# Altium project SealHAT.PrjPcb
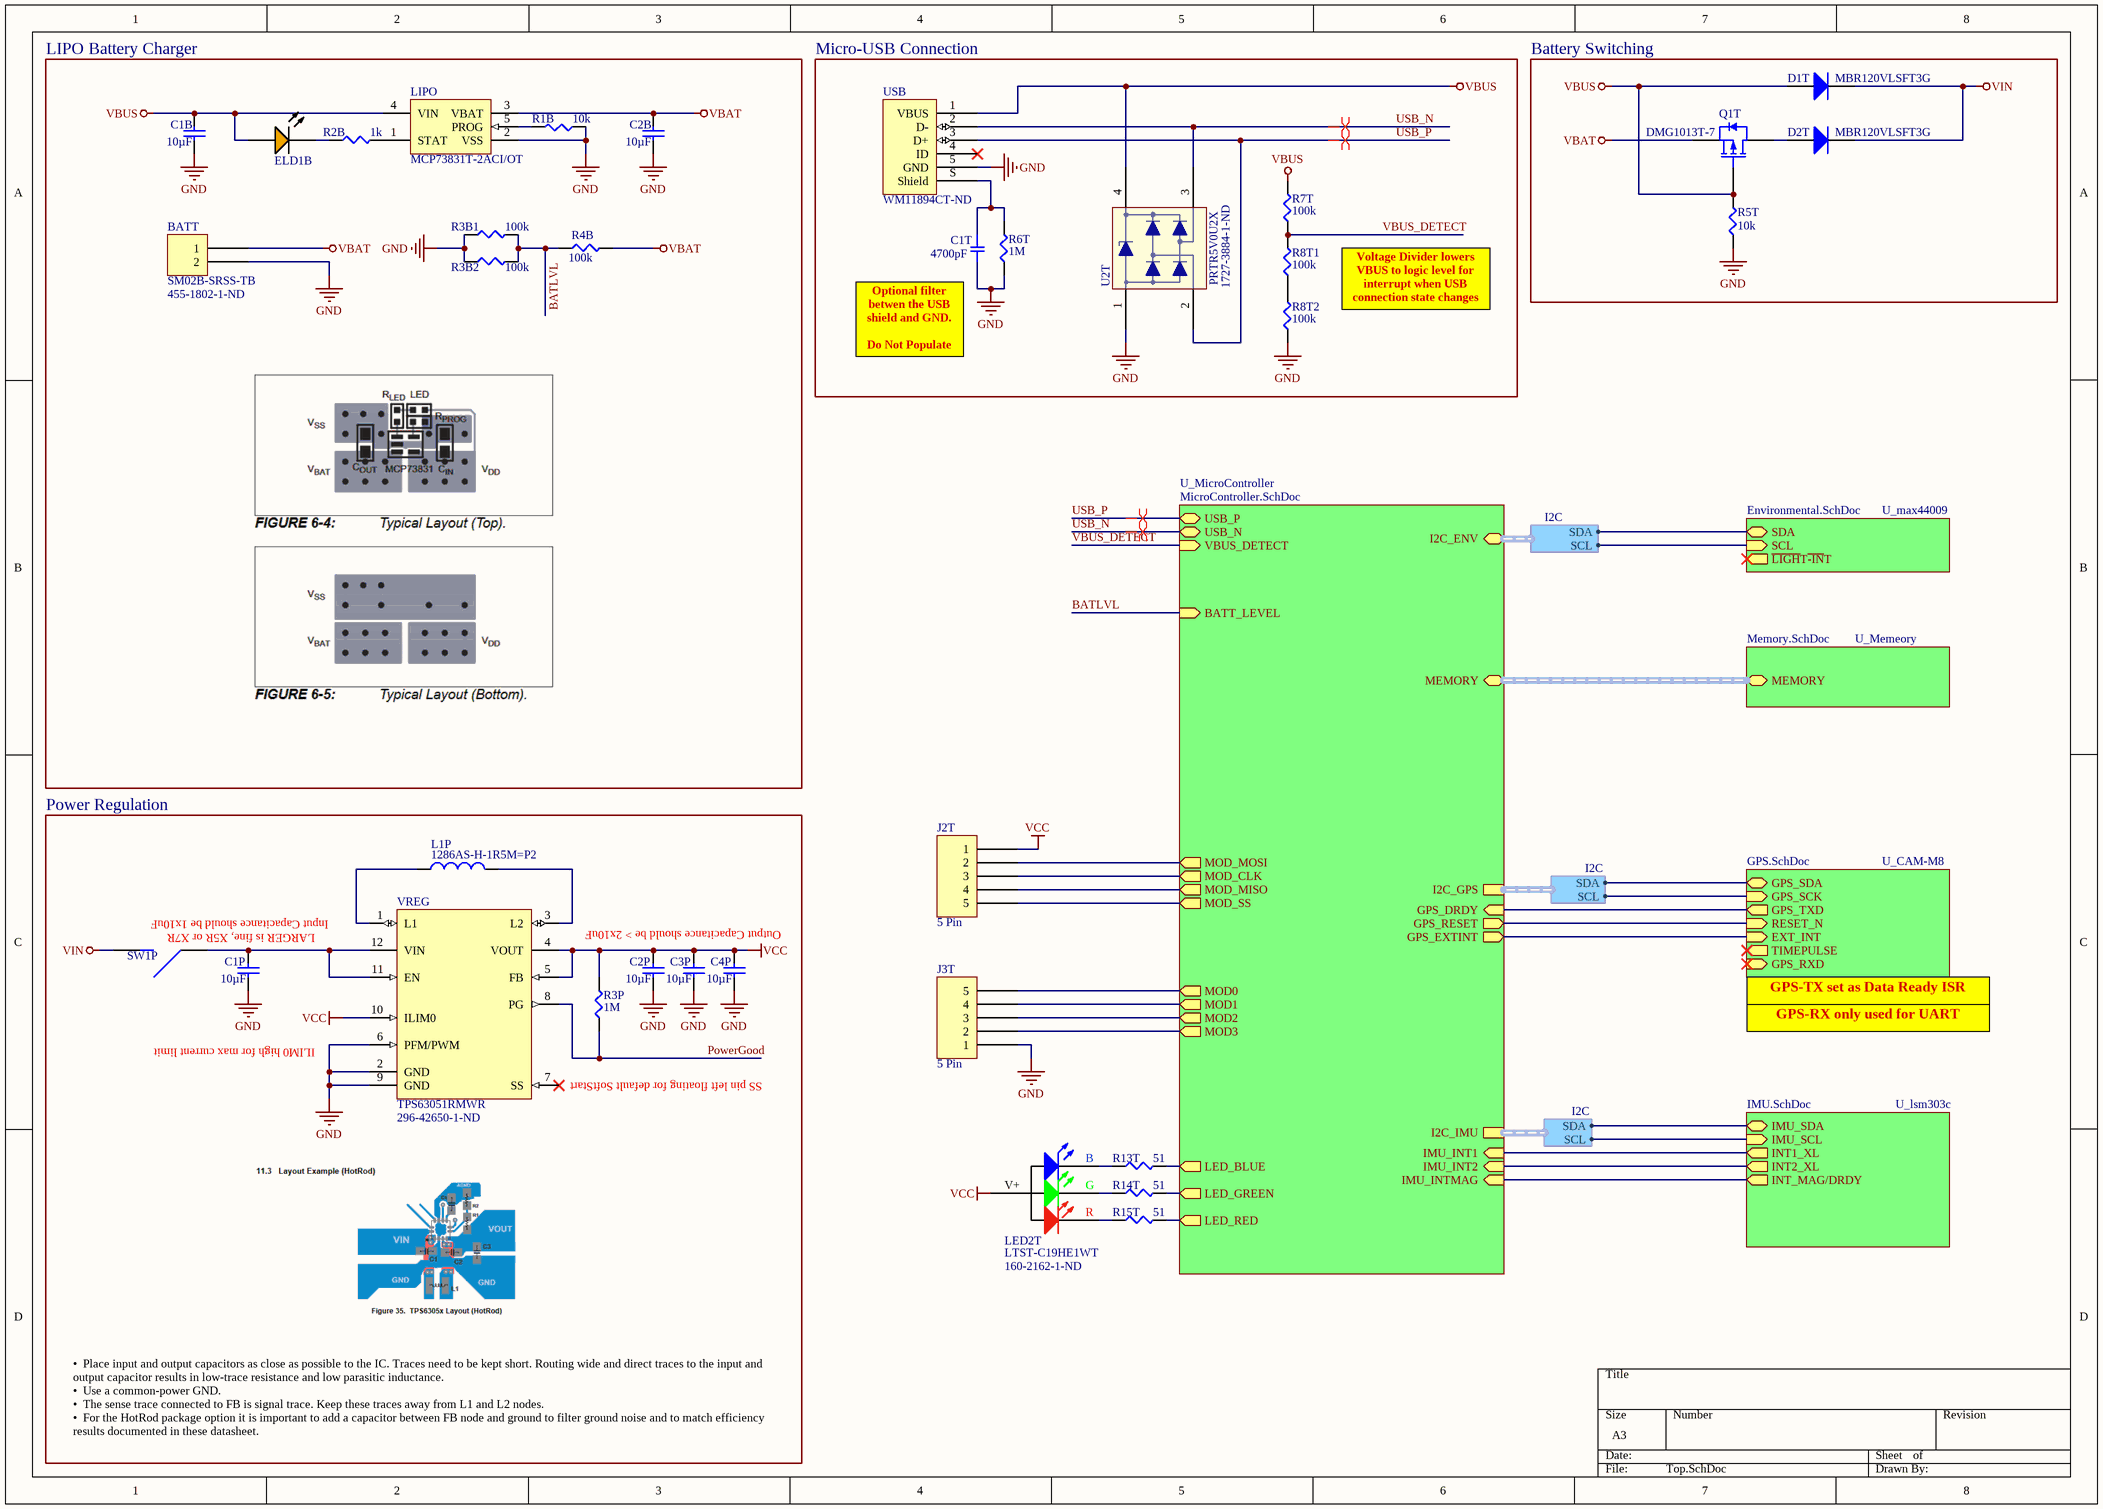
[diagram p0: Top.SchDoc]
6 sheets, 78 parts. Net scope: hierarchical (ports join the sheet entries above them; power ports are global).
Sheets:
  Top.SchDoc
    U_max44009 = Environmental.SchDoc
    U_CAM-M8 = GPS.SchDoc
    U_Memeory = Memory.SchDoc
    U_lsm303c = IMU.SchDoc
    U_MicroController = MicroController.SchDoc

## Sheet Top.SchDoc
size A3; DocumentNumber: 1; SheetNumber: 1; SheetTotal: 6

### Parts
BATT  SM02B-SRSS-TB  Supplier Part Number 1: 455-1802-1-ND  [JST S2B-PH-SM4]
C1B  Capacitance: 10µF  [C0603N]  (hidden comment: GRT188R61C106KE13D)
C1P  Capacitance: 10µF  [C0603N]  (hidden comment: GRT188R61C106KE13D)
C1T  value 4700pF  [C0603N]  (hidden comment: GCM188R72A472KA37D)
C2B  Capacitance: 10µF  [C0603N]  (hidden comment: GRT188R61C106KE13D)
C2P  Capacitance: 10µF  [C0603N]  (hidden comment: GRT188R61C106KE13D)
C3P  Capacitance: 10µF  [C0603N]  (hidden comment: GRT188R61C106KE13D)
C4P  Capacitance: 10µF  [C0603N]  (hidden comment: GRT188R61C106KE13D)
D1T  MBR120VLSFT3G  [MBR120VLSFT3G]
D2T  MBR120VLSFT3G  [MBR120VLSFT3G]
ELD1B  LTST-C190KFKT  [LED_0603]  (value not drawn)
J2T  5 Pin  [Pinhead_1x5]
J3T  5 Pin  [Pinhead_1x5]
L1P  1286AS-H-1R5M=P2  [L0806_N]
LED2T  LTST-C19HE1WT  Supplier Part Number 1: 160-2162-1-ND  [LED_0606_160X160X35]
LIPO  MCP73831T-2ACI/OT  [SOT-23-5_MC]
Q1T  DMG1013T-7  [SOT50P175X90-3N]
R1B  value 10k  [SMD-0603-RES]  (hidden comment: ERJ-3EKF1002V)
R2B  value 1k  [SMD-0603-RES]  (hidden comment: ERJ-3EKF1001V)
R3B1  value 100k  [SMD-0603-RES]  (hidden comment: ERJ-3EKF1003V)
R3B2  value 100k  [SMD-0603-RES]  (hidden comment: ERJ-3EKF1003V)
R3P  value 1M  [SMD-0603-RES]  (hidden comment: ERJ-3EKF1004V)
R4B  value 100k  [SMD-0603-RES]  (hidden comment: ERJ-3EKF1003V)
R5T  value 10k  [SMD-0603-RES]  (hidden comment: ERJ-3EKF1002V)
R6T  value 1M  [SMD-0603-RES]  (hidden comment: ERJ-3EKF1004V)
R7T  value 100k  [SMD-0603-RES]  (hidden comment: ERJ-3EKF1003V)
R8T1  value 100k  [SMD-0603-RES]  (hidden comment: ERJ-3EKF1003V)
R8T2  value 100k  [SMD-0603-RES]  (hidden comment: ERJ-3EKF1003V)
R13T  value 51  [SMD-0603-RES]  (hidden comment: ERJ-3EKF51R0V)
R14T  value 51  [SMD-0603-RES]  (hidden comment: ERJ-3EKF51R0V)
R15T  value 51  [SMD-0603-RES]  (hidden comment: ERJ-3EKF51R0V)
SW1P  SPST  [Pinhead254_90_1x2]  (value not drawn)
U2T  PRTR5V0U2X  Supplier Part Number 1: 1727-3884-1-ND  [SOT143B]
USB  WM11894CT-ND  [MOLEX_105443-1101]
VREG  TPS63051RMWR  Supplier Part Number 1: 296-42650-1-ND  [QFN12P50_250X250X100]

### Blocks framed on the sheet
LIPO Battery Charger: BATT C1B C2B ELD1B LIPO R1B R2B R3B1 R3B2 R4B
Micro-USB Connection: C1T R6T R7T R8T1 R8T2 U2T USB
Battery Switching: D1T D2T Q1T R5T
Power Regulation: C1P C2P C3P C4P L1P R3P SW1P VREG

### Sub-sheets
U_CAM-M8 = GPS.SchDoc: GPS_SCK (in), GPS_SDA (bidir), EXT_INT (in), TIMEPULSE (out), GPS_RXD (in), GPS_TXD (out), RESET_N (in)
U_lsm303c = IMU.SchDoc: IMU_SCL (in), IMU_SDA (bidir), INT1_XL (out), INT_MAG/DRDY (out), INT2_XL (out)
U_max44009 = Environmental.SchDoc: SDA (bidir), SCL (in), ~{LIGH}T~{-IN}T (out)
U_Memeory = Memory.SchDoc: MEMORY (harness MEMORY)
U_MicroController = MicroController.SchDoc: USB_P (bidir), USB_N (bidir), I2C_GPS (harness I2C), VBUS_DETECT (in), BATT_LEVEL (in), GPS_DRDY (in), GPS_EXTINT (out), I2C_IMU (harness I2C), IMU_INT1 (in), IMU_INT2 (in), IMU_INTMAG (in), I2C_ENV (harness I2C), LED_BLUE (out), LED_GREEN (out), LED_RED (out), MOD3 (out), MOD0 (out), MOD_CLK (out), MOD1 (out), MOD_MOSI (out), MOD_SS (out), MOD2 (out), MOD_MISO (out), GPS_RESET (out), MEMORY (harness MEMORY)

### Harnesses
I2C: SCL, SDA

### Nets
GND: BATT.2 C1B.1 C1P.1 C1T.2 C2B.1 C2P.1 C3P.1 C4P.1 J3T.1 LIPO.2(VSS) R1B.1 R3B1.1 R3B2.1 R5T.1 R6T.1 R8T2.1 U2T.1(GND) USB.5(GND) VREG.2(GND) VREG.6(PFM/PWM) VREG.9(GND)
VBAT: BATT.1 C2B.2 LIPO.3(VBAT) Q1T.2(S) R4B.2
VBUS: C1B.2 D1T.1(A) ELD1B.1(A) LIPO.4(VIN) Q1T.1(G) R5T.2 R7T.2 U2T.4(VCC) USB.1(VBUS)
VCC: C2P.2 C3P.2 C4P.2 J2T.1 LED2T.4(A) R3P.2 VREG.4(VOUT) VREG.5(FB) VREG.10(ILIM0)
VIN: D1T.2(K) D2T.2(K) SW1P.2
BATLVL: R3B1.2 R3B2.2 R4B.1 ; sheet U_MicroController/BATT_LEVEL
ENV_SCL: sheet U_max44009/SCL, sheet U_MicroController/I2C_ENV.SCL
ENV_SDA: sheet U_max44009/SDA, sheet U_MicroController/I2C_ENV.SDA
GPS_EXTINT: sheet U_CAM-M8/EXT_INT, sheet U_MicroController/GPS_EXTINT
GPS_RESET: sheet U_CAM-M8/RESET_N, sheet U_MicroController/GPS_RESET
GPS_SCL: sheet U_CAM-M8/GPS_SCK, sheet U_MicroController/I2C_GPS.SCL
GPS_SDA: sheet U_CAM-M8/GPS_SDA, sheet U_MicroController/I2C_GPS.SDA
GPS_TXD: sheet U_CAM-M8/GPS_TXD, sheet U_MicroController/GPS_DRDY
IMU_INT1: sheet U_lsm303c/INT1_XL, sheet U_MicroController/IMU_INT1
IMU_INT2: sheet U_lsm303c/INT2_XL, sheet U_MicroController/IMU_INT2
IMU_INTMAG: sheet U_lsm303c/INT_MAG/DRDY, sheet U_MicroController/IMU_INTMAG
IMU_SCL: sheet U_lsm303c/IMU_SCL, sheet U_MicroController/I2C_IMU.SCL
IMU_SDA: sheet U_lsm303c/IMU_SDA, sheet U_MicroController/I2C_IMU.SDA
LED_BLUE: R13T.2 ; sheet U_MicroController/LED_BLUE
LED_GREEN: R14T.2 ; sheet U_MicroController/LED_GREEN
LED_RED: R15T.2 ; sheet U_MicroController/LED_RED
MOD0: J3T.5 ; sheet U_MicroController/MOD0
MOD1: J3T.4 ; sheet U_MicroController/MOD1
MOD2: J3T.3 ; sheet U_MicroController/MOD2
MOD3: J3T.2 ; sheet U_MicroController/MOD3
MOD_CLK: J2T.3 ; sheet U_MicroController/MOD_CLK
MOD_CS: J2T.5 ; sheet U_MicroController/MOD_SS
MOD_MISO: J2T.4 ; sheet U_MicroController/MOD_MISO
MOD_MOSI: J2T.2 ; sheet U_MicroController/MOD_MOSI
PowerGood: R3P.1 VREG.8(PG)
USB_N: U2T.3(I/O2) USB.2(D-) ; sheet U_MicroController/USB_N
USB_P: U2T.2(I/O1) USB.3(D+) ; sheet U_MicroController/USB_P
VBUS_DETECT: R7T.1 R8T1.2 ; sheet U_MicroController/VBUS_DETECT
NetC1P_2: C1P.2 SW1P.1 VREG.11(EN) VREG.12(VIN)
NetC1T_1: C1T.1 R6T.2 USB.S(Shield)
NetD2T_1: D2T.1(A) Q1T.3(D)
NetELD1B_2: ELD1B.2(K) R2B.1
NetL1P_1: L1P.1 VREG.1(L1)
NetL1P_2: L1P.2 VREG.3(L2)
NetLED2T_1: LED2T.1(R) R15T.1
NetLED2T_2: LED2T.2(G) R14T.1
NetLED2T_3: LED2T.3(B) R13T.1
NetLIPO_1: LIPO.1(STAT) R2B.2
NetLIPO_5: LIPO.5(PROG) R1B.2
NetR8T1_1: R8T1.1 R8T2.2

Not connected (* = marked no-connect by the designer): USB 4(ID)*; VREG 7(SS)*

### Buses and harness runs
harness sheet U_Memeory/MEMORY = sheet U_MicroController/MEMORY

### Layout directives
differential pair: USB_N, USB_P

### Notes on the sheet
- Voltage Divider lowers VBUS to logic level for interrupt when USB connection state changes
- (near C1T) Optional filter betwen the USB shield and GND.
  Do Not Populate
- Input Capacitance should be 1x10uF
- Output Capacitance should be > 2x10uF
- (near SW1P) LARGER is fine, X5R or X7R
- ILIM0 high for max current limit
- GPS-RX only used for UART
- GPS-TX set as Data Ready ISR
- (near VREG) SS pin left floating for default SoftStart
- •  Place input and output capacitors as close as possible to the IC. Traces need to be kept short. Routing wide and direct traces to the input and output capacitor results in low-trace resistance and low parasitic inductance.
  •  Use a common-power GND.
  •  The sense trace connected to FB is signal trace. Keep these traces away from L1 and L2 nodes.
  •  For the HotRod package option it is important to add a capacitor between FB node and ground to filter ground noise and to match efficiency results documented in these datasheet.
- (in symbol LTST-C19HE1WT) V+

### Library data of the parts
BATT = 2 Pin: Part Number: SM02B-SRSS-TB; Supplier 1: Digi-Key
C1B C1P C2B C2P C3P C4P = CAPACITOR_NP: 10µF 16V Ceramic Capacitor X5R 0603; HOUSEPART: NO; POPULATE: 1; TOLERANCE: ±10%; VOLTAGE: 10V; DeviceName: GRT188R61C106KE13D; LibraryName: MF_Passives; DeviceSetName: CAPACITOR_NP; MPN: GRT188R61C106KE13D; MF_PARTNUM: GRT188R61C106KE13D; Supplier 1: Digi-Key; Supplier Part Number 1: 490-12317-1-ND
C1T = GCM188R72A472KA37D: CAP CER 4700PF 100V X7R 0603; Manufacturer: Murata Electronics North America; Factory Stock: 0; Unit Price (USD): 0.1; Minimum Quantity: 1; Tolerance: ±10%; Datasheets: http://www.murata.com/~/media/webrenewal/support/library/catalog/products/capacitor/mlcc/c03e.ashx; Image: //media.digikey.com/Renders/Murata%20Renders/0603%28GCM188%29.jpg; Digi-Key Part Number: 490-4930-1-ND; Part Number: GCM188R72A472KA37D; Quantity Available: 3550; @ qty: 0; Packaging: Cut Tape (CT); Series: GCM; Part Status: Active; Voltage: 100V; Temperature Coefficient: X7R; Operating Temperature: -55°C ~ 125°C; Features: -; Ratings: AEC-Q200; Applications: Automotive; Mounting Type: Surface Mount, MLCC; Package / Case: 0603 (1608 Metric); Size / Dimension: 0.063" L x 0.031" W (1.60mm x 0.80mm); Height - Seated (Max): -; Thickness (Max): 0.035" (0.90mm); Lead Spacing: -; Lead Style: -; Supplier 1: Digi-Key; Supplier Part Number 1: 490-4930-1-ND
D1T D2T = MBR120VLSFT3G: Diode Schottky 20V 1A Surface Mount SOD-123FL; Manufacturer Part Number: MBR120VLSFT3G; Supplier 1: Digi-Key; Supplier Part Number 1: MBR120VLSFT3GOSCT-ND
ELD1B = CMP-1544850-3: LED Uni-Color Orange, 75 mW, 30 mA; Forward Voltage: 2.00 V; Luminous Intensity: 60.0 mcd; Lens Type: Non-Diffused; Wavelength: 611 nm; Viewing Angle: 130 °; Lead-Free Status: Lead Free; Case/Package (SI): 1608; Size-Width: 800 µm; PackageReference: C190KFKT; Size-Height: 800 µm; Color: Orange; Packaging: Cut Tape (CT), Tape & Reel (TR); RoHS: Compliant; Seller Landing  Url: https://octopart-clicks.com/click/track?country=US&ak=8157f166&sig=0e2a9b5&sid=459&ppid=549896&vpid=1324662&ct=offers; Octopart Url: http://octopart.com/ltst-c190kfkt-lite-on-549896; Mounting Style: Surface Mount, Vertical; OctopartID: 99ca50c8d8a4460d; DatasheetVersion: Rev. I, 09/2011; Manufacturer Part Number: LTST-C190KFKT; Case/Package: 0603; Size-Length: 1.60 mm; PackageDescription: 2-Pin Surface Mount Device, Body 1.6 x 0.8 mm; Supplier 1: Digi-Key; Supplier Part Number 1: 160-1434-1-ND
L1P = INDUCTOR: FIXED IND 1.5UH 2A 114 MOHM SMD; POPULATE: 1; DeviceSetName: INDUCTOR; MPN: 1286AS-H-1R5M=P2
LED2T = LTST-C19HE1WT: RGB LED 0606 (1616 metric); Lead-Free Status: Lead Free; Wavelength - Dominant: 624nm Red, 525nm Green, 470nm Blue; package metric: 1616; Configuration: Common Anode; Octopart URL: http://octopart.com/ltst-c19he1wt-lite-on-13128904; OctopartID: 1946d08468e8c681; RoHS: Compliant; Manufacturer Part Number: LTST-C19HE1WT; package: 0606; Height (Max): 0.45mm; Mounting Type: SMT; Supplier 1: Digi-Key
LIPO = MCHP-MCP73831T-5: MCP73831 Series Single-Cell Li-Ion/Li-Polymer Battery Charge Controller SOT-23-5; Input Voltage (DC): 3.75 V (min); Lead-Free Status: Lead Free; Supply Voltage (DC): 6.00 V (max); Output Voltage: 7.30 V; RoHS: Compliant; Octopart URL: https://octopart-clicks.com/click/track?country=US&ak=8157f166&sig=05342b1&sid=459&ppid=55392281&vpid=188043932&ct=offers; OctopartID: d79a1dddcae5085d; Manufacturer Part Number: MCP73831T-2ACI/OT; REACH SVHC Compliance: No SVHC; Case/Package: SOT-23; Lifecycle Status: Active; Packaging: Cut Tape (CT), Tape & Reel (TR); Number of Pins: 5; Mounting Style: Surface Mount; Octopart Url: http://octopart.com/mcp73831t-2aci%2Fot-microchip-55392281; Supplier 1: Digi-Key; Supplier Part Number 1: MCP73831T-2ACI/OTCT-ND
Q1T = DMG1013T-7c2930a883c7b1d54: P-Channel SOT-523; Lead-Free Status: Lead Free; RoHS: Compliant; Lifecycle Status: Active; Polarity: P-Channel; Manufacturer Part Number: DMG1013T-7; REACH SVHC Compliance: No SVHC; Octopart URL: http://octopart.com/dmg1013t-7-diodes+inc.-17947534; OctopartID: c2930a883c7b1d54; Supplier 1: Digi-Key; Supplier Part Number 1: DMG1013T-7DICT-ND
R1B = ERJ-3EKF1002V: RES SMD 10K OHM 1% 1/10W 0603; Manufacturer: Panasonic Electronic Components; Factory Stock: 0; Unit Price (USD): 0.00379; @ qty: 1500; Minimum Quantity: 1; Power (Watts): 0.1W, 1/10W; Temperature Coefficient: ±100ppm/°C; Part Number: ERJ-3EKF1002V; Datasheets: http://industrial.panasonic.com/www-cgi/jvcr13pz.cgi?E+PZ+3+AOA0002+ERJ3EKF1002V+7+WW; Image: //media.digikey.com/Photos/Panasonic%20Photos/MFG_ERJ-P6W%20Series.jpg; Digi-Key Part Number: P10.0KHCT-ND; Quantity Available: 6703141; Packaging: Cut Tape (CT); Series: ERJ; Part Status: Active; Tolerance: ±1%; Composition: Thick Film; Features: Automotive AEC-Q200; Operating Temperature: -55°C ~ 155°C; Package / Case: 0603 (1608 Metric); Supplier Device Package: 0603; Size / Dimension: 0.063" L x 0.031" W (1.60mm x 0.80mm); Height - Seated (Max): 0.022" (0.55mm); Number of Terminations: 2; Failure Rate: -; Supplier 1: Digi-Key; Supplier Part Number 1: P10.0KHCT-ND
R2B = ERJ-3EKF1001V: RES SMD 1K OHM 1% 1/10W 0603; Manufacturer: Panasonic Electronic Components; Factory Stock: 0; Unit Price (USD): 0.00379; @ qty: 1500; Minimum Quantity: 1; Power (Watts): 0.1W, 1/10W; Temperature Coefficient: ±100ppm/°C; Part Number: ERJ-3EKF1001V; Datasheets: http://industrial.panasonic.com/www-cgi/jvcr13pz.cgi?E+PZ+3+AOA0002+ERJ3EKF1001V+7+WW; Image: //media.digikey.com/Photos/Panasonic%20Photos/MFG_ERJ-P6W%20Series.jpg; Digi-Key Part Number: P1.00KHCT-ND; Quantity Available: 5218845; Packaging: Cut Tape (CT); Series: ERJ; Part Status: Active; Tolerance: ±1%; Composition: Thick Film; Features: Automotive AEC-Q200; Operating Temperature: -55°C ~ 155°C; Package / Case: 0603 (1608 Metric); Supplier Device Package: 0603; Size / Dimension: 0.063" L x 0.031" W (1.60mm x 0.80mm); Height - Seated (Max): 0.022" (0.55mm); Number of Terminations: 2; Failure Rate: -; Supplier 1: Digi-Key; Supplier Part Number 1: P1.00KHCT-ND
R3B1 R3B2 R4B = ERJ-3EKF1003V: RES SMD 100K OHM 1% 1/10W 0603; Manufacturer: Panasonic Electronic Components; MPN: P100KHCT-ND; Factory Stock: 0; Unit Price (USD): 0.00379; @ qty: 1500; Minimum Quantity: 1; Power (Watts): 0.1W, 1/10W; Temperature Coefficient: ±100ppm/°C; Part Number: ERJ-3EKF1003V; Datasheets: http://industrial.panasonic.com/www-cgi/jvcr13pz.cgi?E+PZ+3+AOA0002+ERJ3EKF1003V+7+WW; Image: //media.digikey.com/Photos/Panasonic%20Photos/MFG_ERJ-P6W%20Series.jpg; Digi-Key Part Number: P100KHCT-ND; Quantity Available: 2179804; Packaging: Cut Tape (CT); Series: ERJ; Part Status: Active; Tolerance: ±1%; Composition: Thick Film; Features: Automotive AEC-Q200; Operating Temperature: -55°C ~ 155°C; Package / Case: 0603 (1608 Metric); Supplier Device Package: 0603; Size / Dimension: 0.063" L x 0.031" W (1.60mm x 0.80mm); Height - Seated (Max): 0.022" (0.55mm); Number of Terminations: 2; Failure Rate: -; Supplier 1: Digi-Key; Supplier Part Number 1: P100KHCT-ND
R3P R6T = ERJ-3EKF1004V: RES SMD 1M OHM 1% 1/10W 0603; Manufacturer: Panasonic Electronic Components; Factory Stock: 0; Unit Price (USD): 0.00379; @ qty: 1500; Minimum Quantity: 1; Power (Watts): 0.1W, 1/10W; Temperature Coefficient: ±100ppm/°C; Part Number: ERJ-3EKF1004V; Datasheets: http://industrial.panasonic.com/www-cgi/jvcr13pz.cgi?E+PZ+3+AOA0002+ERJ3EKF1004V+7+WW; Image: //media.digikey.com/Photos/Panasonic%20Photos/MFG_ERJ-P6W%20Series.jpg; Digi-Key Part Number: P1.00MHCT-ND; Quantity Available: 1632074; Packaging: Cut Tape (CT); Series: ERJ; Part Status: Active; Tolerance: ±1%; Composition: Thick Film; Features: Automotive AEC-Q200; Operating Temperature: -55°C ~ 155°C; Package / Case: 0603 (1608 Metric); Supplier Device Package: 0603; Size / Dimension: 0.063" L x 0.031" W (1.60mm x 0.80mm); Height - Seated (Max): 0.022" (0.55mm); Number of Terminations: 2; Failure Rate: -; Supplier 1: Digi-Key; Supplier Part Number 1: P1.00MHCT-ND
R5T = ERJ-3EKF1002V: RES SMD 10K OHM 1% 1/10W 0603; Manufacturer: Panasonic Electronic Components; MPN: P10.0KHCT-ND; Factory Stock: 0; Unit Price (USD): 0.00379; @ qty: 1500; Minimum Quantity: 1; Power (Watts): 0.1W, 1/10W; Temperature Coefficient: ±100ppm/°C; Part Number: ERJ-3EKF1002V; Datasheets: http://industrial.panasonic.com/www-cgi/jvcr13pz.cgi?E+PZ+3+AOA0002+ERJ3EKF1002V+7+WW; Image: //media.digikey.com/Photos/Panasonic%20Photos/MFG_ERJ-P6W%20Series.jpg; Digi-Key Part Number: P10.0KHCT-ND; Quantity Available: 6703141; Packaging: Cut Tape (CT); Series: ERJ; Part Status: Active; Tolerance: ±1%; Composition: Thick Film; Features: Automotive AEC-Q200; Operating Temperature: -55°C ~ 155°C; Package / Case: 0603 (1608 Metric); Supplier Device Package: 0603; Size / Dimension: 0.063" L x 0.031" W (1.60mm x 0.80mm); Height - Seated (Max): 0.022" (0.55mm); Number of Terminations: 2; Failure Rate: -; Supplier 1: Digi-Key; Supplier Part Number 1: P10.0KHCT-ND
R7T R8T1 R8T2 = ERJ-3EKF1003V: RES SMD 100K OHM 1% 1/10W 0603; Manufacturer: Panasonic Electronic Components; Factory Stock: 0; Unit Price (USD): 0.00379; @ qty: 1500; Minimum Quantity: 1; Power (Watts): 0.1W, 1/10W; Temperature Coefficient: ±100ppm/°C; Part Number: ERJ-3EKF1003V; Datasheets: http://industrial.panasonic.com/www-cgi/jvcr13pz.cgi?E+PZ+3+AOA0002+ERJ3EKF1003V+7+WW; Image: //media.digikey.com/Photos/Panasonic%20Photos/MFG_ERJ-P6W%20Series.jpg; Digi-Key Part Number: P100KHCT-ND; Quantity Available: 2179804; Packaging: Cut Tape (CT); Series: ERJ; Part Status: Active; Tolerance: ±1%; Composition: Thick Film; Features: Automotive AEC-Q200; Operating Temperature: -55°C ~ 155°C; Package / Case: 0603 (1608 Metric); Supplier Device Package: 0603; Size / Dimension: 0.063" L x 0.031" W (1.60mm x 0.80mm); Height - Seated (Max): 0.022" (0.55mm); Number of Terminations: 2; Failure Rate: -; Supplier 1: Digi-Key; Supplier Part Number 1: P100KHCT-ND
R13T R14T R15T = ERJ-3EKF51R0V: RES SMD 51 OHM 1% 1/10W 0603; Manufacturer: Panasonic Electronic Components; Factory Stock: 0; Unit Price (USD): 0.00379; @ qty: 1500; Minimum Quantity: 1; Power (Watts): 0.1W, 1/10W; Temperature Coefficient: ±100ppm/°C; Part Number: ERJ-3EKF51R0V; Datasheets: http://industrial.panasonic.com/www-cgi/jvcr13pz.cgi?E+PZ+3+AOA0002+ERJ3EKF51R0V+7+WW; Image: //media.digikey.com/Photos/Panasonic%20Photos/MFG_ERJ-P6W%20Series.jpg; Digi-Key Part Number: P51.0HCT-ND; Quantity Available: 129747; Packaging: Cut Tape (CT); Series: ERJ; Part Status: Active; Tolerance: ±1%; Composition: Thick Film; Features: Automotive AEC-Q200; Operating Temperature: -55°C ~ 155°C; Package / Case: 0603 (1608 Metric); Supplier Device Package: 0603; Size / Dimension: 0.063" L x 0.031" W (1.60mm x 0.80mm); Height - Seated (Max): 0.022" (0.55mm); Number of Terminations: 2; Failure Rate: -; Supplier 1: Digi-Key; Supplier Part Number 1: P51.0HCT-ND
SW1P = SPST switch
U2T = PRTR5V0U2X: C: Copyright (C) 2015 Accelerated Designs. All rights reserved; Vendor: NXP; Built_By: EMA_UL_Team; Value: PRTR5V0U2X; Manufacturer_Part_Number: PRTR5V0U2X; Supplier 1: Digi-Key
USB = USB 2.0 Type B Micro: Supplier 1: Digi-Key; Supplier Part Number 1: WM11894CT-ND
VREG = TPS63051RMWR: Single Inductor Buck Boost Converter 12-VQFN; Manufacturer: Texas Instruments; Current - Output: 500mA; Vin Min: 2.5V; Vin Max: 5.5V; Freqency: 2.5MHz; Package: 12-VFQFN; MPN: TPS63051RMWR; Value: *; Supplier 1: Digi-Key

## Sheet Environmental.SchDoc: SealHAT: Environmental Subsystem
size Letter
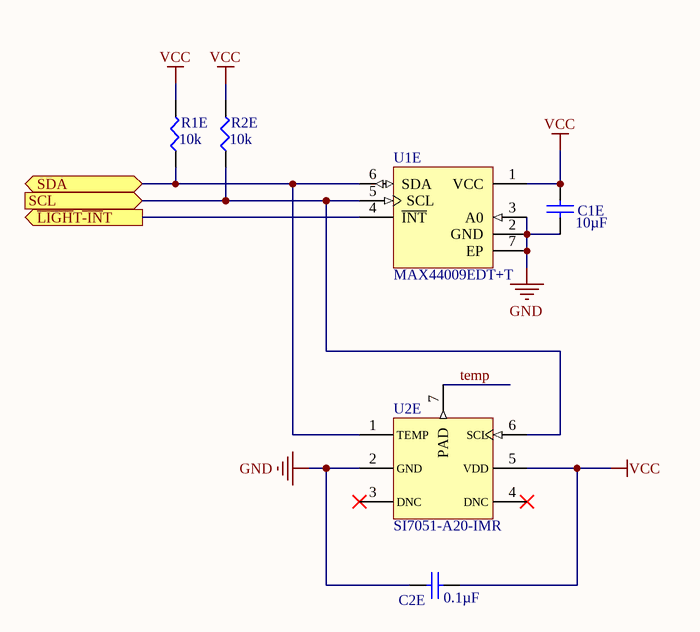
[diagram p1: Environmental.SchDoc]

### Parts
C1E  Capacitance: 10µF  [C0603N]  (hidden comment: GRT188R61C106KE13D)
C2E  Capacitance: 0.1µF  [C0603N]  (hidden comment: GCM188R71C104KA37D)
R1E  value 10k  [SMD-0603-RES]  (hidden comment: ERJ-3EKF1002V)
R2E  value 10k  [SMD-0603-RES]  (hidden comment: ERJ-3EKF1002V)
U1E  MAX44009EDT+T  [21-0490D]
U2E  SI7051-A20-IMR  [si705x-hand]

### Ports
SCL (in), SDA (bidir), ~{LIGH}T~{-IN}T (out)

### Nets
GND: C1E.1 C2E.1 U1E.2(GND) U1E.3(A0) U1E.7(EP) U2E.2(GND)
VCC: C1E.2 C2E.2 R1E.2 R2E.2 U1E.1(VCC) U2E.5(VDD)
~{LIGH}T~{-IN}T: U1E.4(~{INT}) ; port ~{LIGH}T~{-IN}T
ENV_SCL: R2E.1 U1E.5(SCL) U2E.6(SCL) ; port SCL
ENV_SDA: R1E.1 U1E.6(SDA) U2E.1(TEMP) ; port SDA
temp: U2E.7(PAD)

Not connected (* = marked no-connect by the designer): U2E 3(DNC)* 4(DNC)*

### Notes on the sheet
- Title
- Size:
- Date:
- Letter
- Number:
- Time:
- Revision:
- Sheet
- of
- File:

### Library data of the parts
C1E = CAPACITOR_NP: as C1B on sheet Top; DeviceName: GRT188R61C106KE13D; LibraryName: MF_Passives; DeviceSetName: CAPACITOR_NP; MPN: GRT188R61C106KE13D; MF_PARTNUM: GRT188R61C106KE13D; Supplier 1: Digi-Key; Supplier Part Number 1: 490-12317-1-ND
C2E = CAPACITOR_NP: HOUSEPART: NO; POPULATE: 1; TOLERANCE: ±10%; VOLTAGE: 16V; Temperature Coefficient: X7R; DeviceName: GCM188R71C104KA37D; LibraryName: MF_Passives; DeviceSetName: CAPACITOR_NP; MPN: GCM188R71C104KA37D; MF_PARTNUM: GCM188R71C104KA37D; Supplier 1: Digi-Key; Supplier Part Number 1: 490-4774-1-ND
R1E R2E = ERJ-3EKF1002V: as R1B on sheet Top; Part Number: ERJ-3EKF1002V; Datasheets: http://industrial.panasonic.com/www-cgi/jvcr13pz.cgi?E+PZ+3+AOA0002+ERJ3EKF1002V+7+WW; Image: //media.digikey.com/Photos/Panasonic%20Photos/MFG_ERJ-P6W%20Series.jpg; Digi-Key Part Number: P10.0KHCT-ND; Quantity Available: 6703141; Packaging: Cut Tape (CT); Series: ERJ; Part Status: Active; Tolerance: ±1%; Composition: Thick Film; Features: Automotive AEC-Q200; Operating Temperature: -55°C ~ 155°C; Package / Case: 0603 (1608 Metric); Supplier Device Package: 0603; Size / Dimension: 0.063" L x 0.031" W (1.60mm x 0.80mm); Height - Seated (Max): 0.022" (0.55mm); Number of Terminations: 2; Failure Rate: -; Supplier 1: Digi-Key; Supplier Part Number 1: P10.0KHCT-ND
U1E = MAX44009EDT+T: MAX44009 light sensor; Octopart Url: https://octopart.com/max44009edt%2Bt-maxim+integrated-44380498; Manufacturer Part Number: MAX44009EDT+T; Lifecycle Status: Active; OctopartID: e71f2cb0f32b38d8; Case/Package: 6-UDFN; Supplier 1: Digi-Key; Supplier Part Number 1: MAX44009EDT+TCT-ND
U2E = CMP-6e6fa3261226b1a8-2: Temperature Sensor tal, Local -40°C ~ 125°C 14 b 6-DFN (3x3); Octopart URL: https://octopart.com/si7051-a20-im-silicon+labs-71522607; RoHS: Compliant; Case/Package: 6-DFN; Manufacturer Part Number: SI7051-A20-IMR; Supplier 1: Digi-Key; Supplier Part Number 1: 336-4764-1-ND

## Sheet GPS.SchDoc: SealHAT: GPS Subsystem
size Letter; DocumentNumber: 5; SheetNumber: 5; SheetTotal: 6
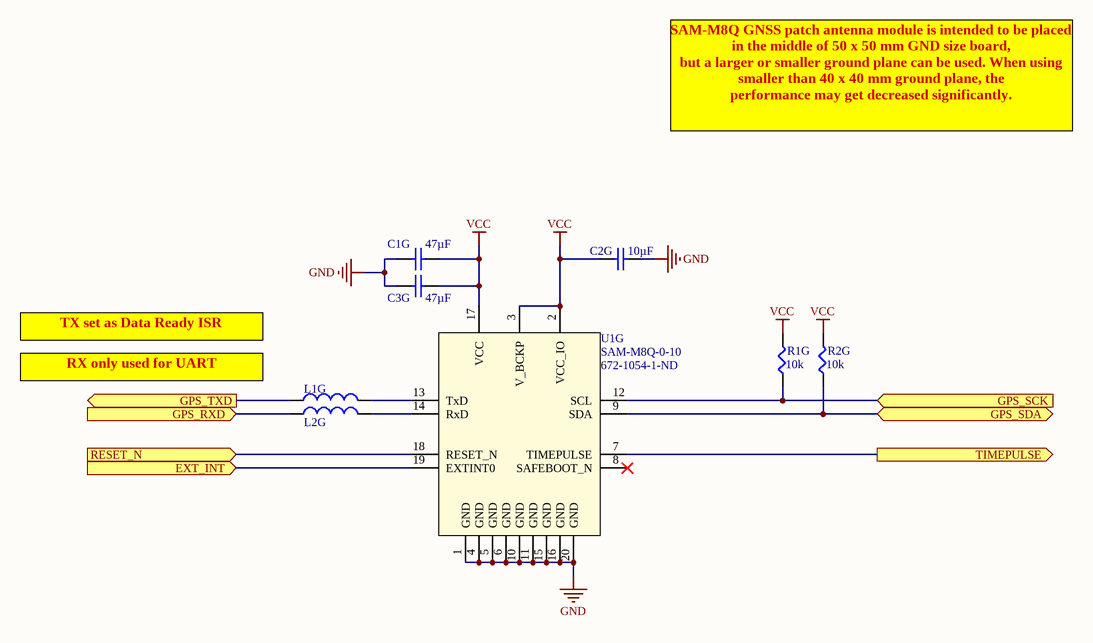
[diagram p2: GPS.SchDoc]

### Parts
C1G  Capacitance: 47µF  [C0805N]  (hidden comment: GRM21BR61A476ME15L)
C2G  Capacitance: 10µF  [C0603N]  (hidden comment: GRT188R61C106KE13D)
C3G  Capacitance: 47µF  [C0805N]  (hidden comment: GRM21BR61A476ME15L)
L1G  LI0603G221R-10  [R0603L]  (value not drawn)
L2G  LI0603G221R-10  [R0603L]  (value not drawn)
R1G  value 10k  [SMD-0603-RES]  (hidden comment: ERJ-3EKF1002V)
R2G  value 10k  [SMD-0603-RES]  (hidden comment: ERJ-3EKF1002V)
U1G  SAM-M8Q-0-10  Supplier Part Number 1: 672-1054-1-ND  [SAM-M8Q]

### Ports
EXT_INT (in), GPS_RXD (in), GPS_SCK (in), GPS_SDA (bidir), GPS_TXD (out), RESET_N (in), TIMEPULSE (out)

### Nets
GND: C1G.2 C2G.2 C3G.2 U1G.1(GND) U1G.4(GND) U1G.5(GND) U1G.6(GND) U1G.10(GND) U1G.11(GND) U1G.15(GND) U1G.16(GND) U1G.20(GND)
VCC: C1G.1 C2G.1 C3G.1 R1G.2 R2G.2 U1G.2(VCC_IO) U1G.3(V_BCKP) U1G.17(VCC)
GPS_EXTINT: U1G.19(EXTINT0) ; port EXT_INT
GPS_RESET: U1G.18(RESET_N) ; port RESET_N
GPS_RXD: L2G.1 ; port GPS_RXD
GPS_SCL: R1G.1 U1G.12(SCL) ; port GPS_SCK
GPS_SDA: R2G.1 U1G.9(SDA) ; port GPS_SDA
GPS_TXD: L1G.1 ; port GPS_TXD
TIMEPULSE: U1G.7(TIMEPULSE) ; port TIMEPULSE
NetL1G_2: L1G.2 U1G.13(TxD)
NetL2G_2: L2G.2 U1G.14(RxD)

Not connected (* = marked no-connect by the designer): U1G 8(SAFEBOOT_N)*

### Notes on the sheet
- SAM‑M8Q GNSS patch antenna module is intended to be placed in the middle of 50 x 50 mm GND size board,
  but a larger or smaller ground plane can be used. When using smaller than 40 x 40 mm ground plane, the
  performance may get decreased significantly.
- TX set as Data Ready ISR
- RX only used for UART
- Title
- Size:
- Date:
- Letter
- Number:
- Time:
- Revision:
- Sheet
- of
- File:

### Library data of the parts
C1G C3G = CAPACITOR_NP: 47µF 10V Ceramic Capacitor X5R 0805; HOUSEPART: NO; POPULATE: 1; TOLERANCE: ±20%; VOLTAGE: 6.3V; DeviceName: GRM21BR61A476ME15L; LibraryName: MF_Passives; DeviceSetName: CAPACITOR_NP; MPN: GRM21BR61A476ME15L; URL: https://octopart.com/cl21a476mqclrnc-samsung-24871259; MF_PARTNUM: GRM21BR61A476ME15L; Temperature Coefficient: X5R; Supplier 1: Digi-Key; Supplier Part Number 1: 490-9961-1-ND
C2G = CAPACITOR_NP: as C1B on sheet Top; DeviceName: GRT188R61C106KE13D; LibraryName: MF_Passives; DeviceSetName: CAPACITOR_NP; MPN: GRT188R61C106KE13D; MF_PARTNUM: GRT188R61C106KE13D; Supplier 1: Digi-Key; Supplier Part Number 1: 490-12317-1-ND
L1G L2G = INDUCTOR: HOUSEPART: NO; POPULATE: 1; LibraryName: MF_Passives; DeviceSetName: INDUCTOR; MPN: LI0603G221R-10; URL: https://www.digikey.com/product-detail/en/laird-signal-integrity-products/LI0603G221R-10/240-2368-1-ND/806728; Supplier 1: Digi-Key; Supplier Part Number 1: 240-2368-1-ND
R1G R2G = ERJ-3EKF1002V: as R1B on sheet Top; Part Number: ERJ-3EKF1002V; Datasheets: http://industrial.panasonic.com/www-cgi/jvcr13pz.cgi?E+PZ+3+AOA0002+ERJ3EKF1002V+7+WW; Image: //media.digikey.com/Photos/Panasonic%20Photos/MFG_ERJ-P6W%20Series.jpg; Digi-Key Part Number: P10.0KHCT-ND; Quantity Available: 6703141; Packaging: Cut Tape (CT); Series: ERJ; Part Status: Active; Tolerance: ±1%; Composition: Thick Film; Features: Automotive AEC-Q200; Operating Temperature: -55°C ~ 155°C; Package / Case: 0603 (1608 Metric); Supplier Device Package: 0603; Size / Dimension: 0.063" L x 0.031" W (1.60mm x 0.80mm); Height - Seated (Max): 0.022" (0.55mm); Number of Terminations: 2; Failure Rate: -; Supplier 1: Digi-Key; Supplier Part Number 1: P10.0KHCT-ND
U1G = ublox-sam-m8Q: u-Blox M8 Gnss Antenna Module Tc; Octopart URL: https://octopart.com/sam-m8q-0-10-u-blox-88247750; Manufacturer Part Number: SAM-M8Q-0-10; OctopartID: 87e74baf2f475820; Case/Package: SAM-M8Q; Supplier 1: Digi-Key

## Sheet Memory.SchDoc
size A4; DocumentNumber: 6; SheetNumber: 6; SheetTotal: 6
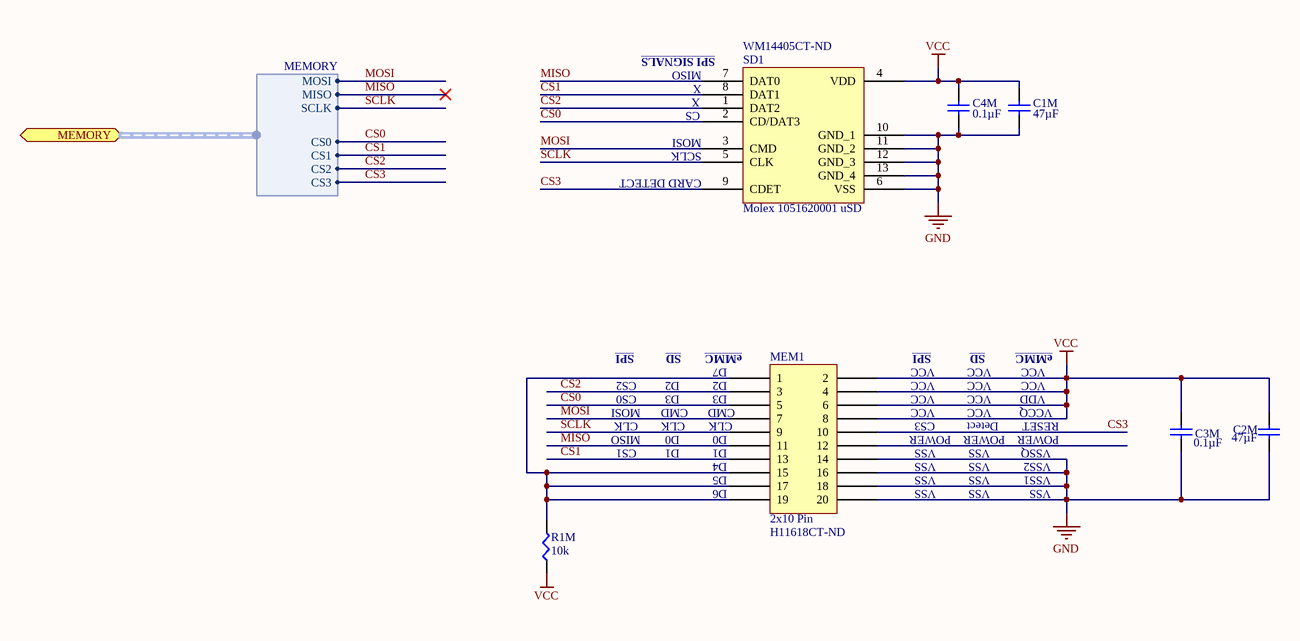
[diagram p3: Memory.SchDoc]

### Parts
C1M  Capacitance: 47µF  [C0805N]  (hidden comment: GRM21BR61A476ME15L)
C2M  Capacitance: 47µF  [C0805N]  (hidden comment: GRM21BR61A476ME15L)
C3M  Capacitance: 0.1µF  [C0603N]  (hidden comment: GCM188R71C104KA37D)
C4M  Capacitance: 0.1µF  [C0603N]  (hidden comment: GCM188R71C104KA37D)
MEM1  2x10 Pin  Supplier Part Number 1: H11618CT-ND  [HIROSE DF40C-20DP-N]
R1M  value 10k  [SMD-0603-RES]  (hidden comment: ERJ-3EKF1002V)
SD1  Molex 1051620001 uSD  Supplier Part Number 1: WM14405CT-ND  [Molex 1051620001]

### Ports
MEMORY (harness MEMORY)

### Harnesses
MEMORY: CS0, CS1, CS2, CS3, MISO, MOSI, SCLK

### Nets
GND: C1M.1 C2M.1 C3M.1 C4M.1 MEM1.14 MEM1.16 MEM1.18 MEM1.20 SD1.6(VSS) SD1.10(GND_1) SD1.11(GND_2) SD1.12(GND_3) SD1.13(GND_4)
VCC: C1M.2 C2M.2 C3M.2 C4M.2 MEM1.2 MEM1.4 MEM1.6 MEM1.8 R1M.1 SD1.4(VDD)
CS0: MEM1.5 SD1.2(CD/DAT3) ; port MEMORY.CS0
CS1: MEM1.13 SD1.8(DAT1) ; port MEMORY.CS1
CS2: MEM1.3 SD1.1(DAT2) ; port MEMORY.CS2
CS3: MEM1.10 SD1.9(CDET) ; port MEMORY.CS3
MISO: MEM1.11 SD1.7(DAT0) ; port MEMORY.MISO  [project net MEM_MISO]
MOSI: MEM1.7 SD1.3(CMD) ; port MEMORY.MOSI  [project net MEM_MOSI]
SCLK: MEM1.9 SD1.5(CLK) ; port MEMORY.SCLK  [project net MEM_CLK]
NetMEM1_1: MEM1.1 MEM1.15 MEM1.17 MEM1.19 R1M.2

Not connected (* = marked no-connect by the designer): MEM1 12

### Notes on the sheet
- (near SD1) X
- (near SD1) CS
- (near SD1) MISO
- (near SD1) SPI SIGNALS
- (near SD1) MOSI
- (near SD1) SCLK
- (near SD1) CARD DETECT
- SPI
- CS2
- D2
- SD
- (near MEM1) D2
- (near MEM1) D7
- (near MEM1) eMMC
- VCC
- eMMC
- CS0
- CS1
- CLK
- MOSI
- MISO
- D3
- D0
- D1
- CMD
- (near MEM1) D3
- (near MEM1) D0
- (near MEM1) D1
- (near MEM1) CLK
- (near MEM1) CMD
- CS3
- VSS
- POWER
- Detect
- VDD
- VSSQ
- VCCQ
- RESET
- (near MEM1) D4
- (near MEM1) D5
- (near MEM1) D6
- VSS2
- VSS1

### Library data of the parts
C1M C2M = CAPACITOR_NP: as C1G on sheet GPS; DeviceName: GRM21BR61A476ME15L; LibraryName: MF_Passives; DeviceSetName: CAPACITOR_NP; MPN: GRM21BR61A476ME15L; URL: https://octopart.com/cl21a476mqclrnc-samsung-24871259; MF_PARTNUM: GRM21BR61A476ME15L; Temperature Coefficient: X5R; Supplier 1: Digi-Key; Supplier Part Number 1: 490-9961-1-ND
C3M C4M = CAPACITOR_NP: as C2E on sheet Environmental; DeviceName: GCM188R71C104KA37D; LibraryName: MF_Passives; DeviceSetName: CAPACITOR_NP; MPN: GCM188R71C104KA37D; MF_PARTNUM: GCM188R71C104KA37D; Supplier 1: Digi-Key; Supplier Part Number 1: 490-4774-1-ND
MEM1 = 2x10 Pin: CONN HDR 20POS; Supplier 1: Digi-Key
R1M = ERJ-3EKF1002V: as R1B on sheet Top; Part Number: ERJ-3EKF1002V; Datasheets: http://industrial.panasonic.com/www-cgi/jvcr13pz.cgi?E+PZ+3+AOA0002+ERJ3EKF1002V+7+WW; Image: //media.digikey.com/Photos/Panasonic%20Photos/MFG_ERJ-P6W%20Series.jpg; Digi-Key Part Number: P10.0KHCT-ND; Quantity Available: 6703141; Packaging: Cut Tape (CT); Series: ERJ; Part Status: Active; Tolerance: ±1%; Composition: Thick Film; Features: Automotive AEC-Q200; Operating Temperature: -55°C ~ 155°C; Package / Case: 0603 (1608 Metric); Supplier Device Package: 0603; Size / Dimension: 0.063" L x 0.031" W (1.60mm x 0.80mm); Height - Seated (Max): 0.022" (0.55mm); Number of Terminations: 2; Failure Rate: -; Supplier 1: Digi-Key; Supplier Part Number 1: P10.0KHCT-ND
SD1 = Molex 1051620001 uSD: 1.45H MICRO SD HEADER WITH D/C P; Supplier 1: Digi-Key

## Sheet IMU.SchDoc
size A; DocumentNumber: 4; SheetNumber: 4; SheetTotal: 6
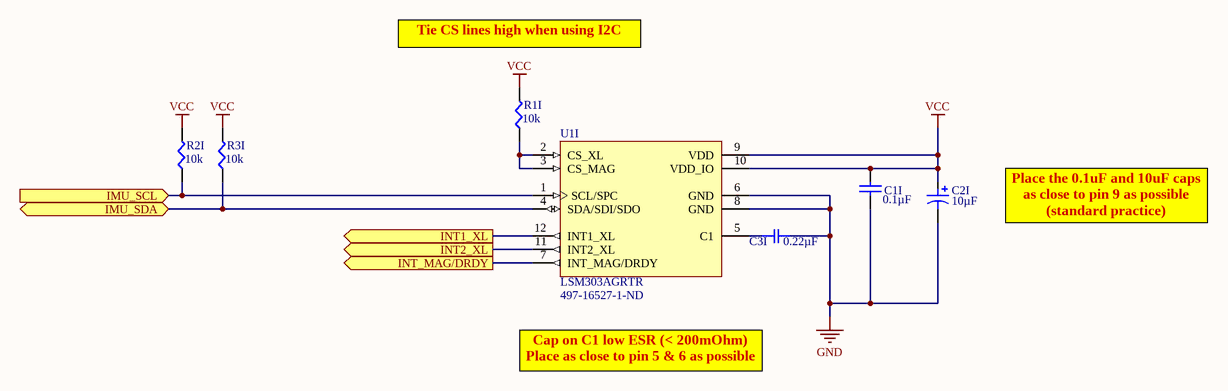
[diagram p4: IMU.SchDoc]

### Parts
C1I  Capacitance: 0.1µF  [C0603N]  (hidden comment: GCM188R71C104KA37D)
C2I  value 10µF  [2917]  (hidden comment: EEF-CD1B100R)
C3I  value 0.22µF  [C0603N]  (hidden comment: GCM188R71E224KA55J)
R1I  value 10k  [SMD-0603-RES]  (hidden comment: ERJ-3EKF1002V)
R2I  value 10k  [SMD-0603-RES]  (hidden comment: ERJ-3EKF1002V)
R3I  value 10k  [SMD-0603-RES]  (hidden comment: ERJ-3EKF1002V)
U1I  LSM303AGRTR  Supplier Part Number 1: 497-16527-1-ND  [LGA12R50P_200X200X100]

### Ports
IMU_SCL (in), IMU_SDA (bidir), INT1_XL (out), INT2_XL (out), INT_MAG/DRDY (out)

### Nets
GND: C1I.1 C2I.2 C3I.2 U1I.6(GND) U1I.8(GND)
VCC: C1I.2 C2I.1 R1I.2 R2I.2 R3I.2 U1I.9(VDD) U1I.10(VDD_IO)
IMU_INT1: U1I.12(INT1_XL) ; port INT1_XL
IMU_INT2: U1I.11(INT2_XL) ; port INT2_XL
IMU_INTMAG: U1I.7(INT_MAG/DRDY) ; port INT_MAG/DRDY
IMU_SCL: R2I.1 U1I.1(SCL/SPC) ; port IMU_SCL
IMU_SDA: R3I.1 U1I.4(SDA/SDI/SDO) ; port IMU_SDA
NetC3I_1: C3I.1 U1I.5(C1)
NetR1I_1: R1I.1 U1I.2(CS_XL) U1I.3(CS_MAG)

### Notes on the sheet
- Tie CS lines high when using I2C
- Place the 0.1uF and 10uF caps as close to pin 9 as possible (standard practice)
- Cap on C1 low ESR (< 200mOhm)
  Place as close to pin 5 & 6 as possible

### Library data of the parts
C1I = CAPACITOR_NP: as C2E on sheet Environmental; DeviceName: GCM188R71C104KA37D; LibraryName: MF_Passives; DeviceSetName: CAPACITOR_NP; MPN: GCM188R71C104KA37D; MF_PARTNUM: GCM188R71C104KA37D; Supplier 1: Digi-Key; Supplier Part Number 1: 490-4774-1-ND
C2I = CAPACITOR_P: 10µF 12.5V Aluminum Polymer Capacitor 2917 (7343 Metric) 60 mOhm 1000 Hrs @ 105°C; HOUSEPART: NO; POPULATE: 1; TOLERANCE: 20%; DeviceSetName: CAPACITOR_P; MPN: EEF-CD1B100R; URL: https://www.digikey.com/product-detail/en/panasonic-electronic-components/EEF-CD1B100R/PCE3166CT-ND/256706; VOLTAGE: 12.5V; Supplier 1: Digi-Key; Supplier Part Number 1: PCE3166CT-ND
C3I = GCM188R71E224KA55J: CAP CER 0.22UF 25V X7R 0603; Manufacturer: Murata Electronics North America; Factory Stock: 0; Unit Price (USD): 0.1; Minimum Quantity: 1; Tolerance: ±10%; Datasheets: http://www.murata.com/~/media/webrenewal/support/library/catalog/products/capacitor/mlcc/c03e.ashx; Image: //media.digikey.com/Renders/Murata%20Renders/0603%28GCM188%29.jpg; Digi-Key Part Number: 490-8017-1-ND; Part Number: GCM188R71E224KA55J; Quantity Available: 10849; @ qty: 0; Packaging: Cut Tape (CT); Series: GCM; Part Status: Active; Voltage: 25V; Temperature Coefficient: X7R; Operating Temperature: -55°C ~ 125°C; Features: -; Ratings: AEC-Q200; Applications: Automotive; Mounting Type: Surface Mount, MLCC; Package / Case: 0603 (1608 Metric); Size / Dimension: 0.063" L x 0.031" W (1.60mm x 0.80mm); Height - Seated (Max): -; Thickness (Max): 0.035" (0.90mm); Lead Spacing: -; Lead Style: -; Supplier 1: Digi-Key; Supplier Part Number 1: 490-8017-1-ND
R1I R2I R3I = ERJ-3EKF1002V: as R1B on sheet Top; Part Number: ERJ-3EKF1002V; Datasheets: http://industrial.panasonic.com/www-cgi/jvcr13pz.cgi?E+PZ+3+AOA0002+ERJ3EKF1002V+7+WW; Image: //media.digikey.com/Photos/Panasonic%20Photos/MFG_ERJ-P6W%20Series.jpg; Digi-Key Part Number: P10.0KHCT-ND; Quantity Available: 6703141; Packaging: Cut Tape (CT); Series: ERJ; Part Status: Active; Tolerance: ±1%; Composition: Thick Film; Features: Automotive AEC-Q200; Operating Temperature: -55°C ~ 155°C; Package / Case: 0603 (1608 Metric); Supplier Device Package: 0603; Size / Dimension: 0.063" L x 0.031" W (1.60mm x 0.80mm); Height - Seated (Max): 0.022" (0.55mm); Number of Terminations: 2; Failure Rate: -; Supplier 1: Digi-Key; Supplier Part Number 1: P10.0KHCT-ND
U1I = CMP-98f6527696964731-1: Ultra-compact high-performance eCompass module: ultra-low power 3D accelerometer and 3D magnetometer; Lifecycle Status: Active; Packaging: Cut Tape (CT); Octopart URL: http://octopart.com/lsm303agrtr-stmicroelectronics-59386630; Manufacturer Part Number: LSM303AGRTR; Case/Package: LGA-12; Supplier 1: Digi-Key

## Sheet MicroController.SchDoc: SealHAT - SAML21 Microcontroller
size Letter; DocumentNumber: 2; SheetNumber: 2; SheetTotal: 6; PageSetup: Record=PageOptions|CenterHorizontal=True|CenterVertical=True|PrintScale=0.94|XCorrection=1.00|YCorrection=1.00|PrintKind=1|BorderSize=5000000|LeftOffset=0|BottomOffset=0|Orientation=2|PaperLength=1000|PaperWidth=1000|Scale=100|PaperSource=7|PrintQuality=-3|MediaType=1|DitherType=10|PrintScaleMode=1|PaperKind=Letter|PaperIndex=1
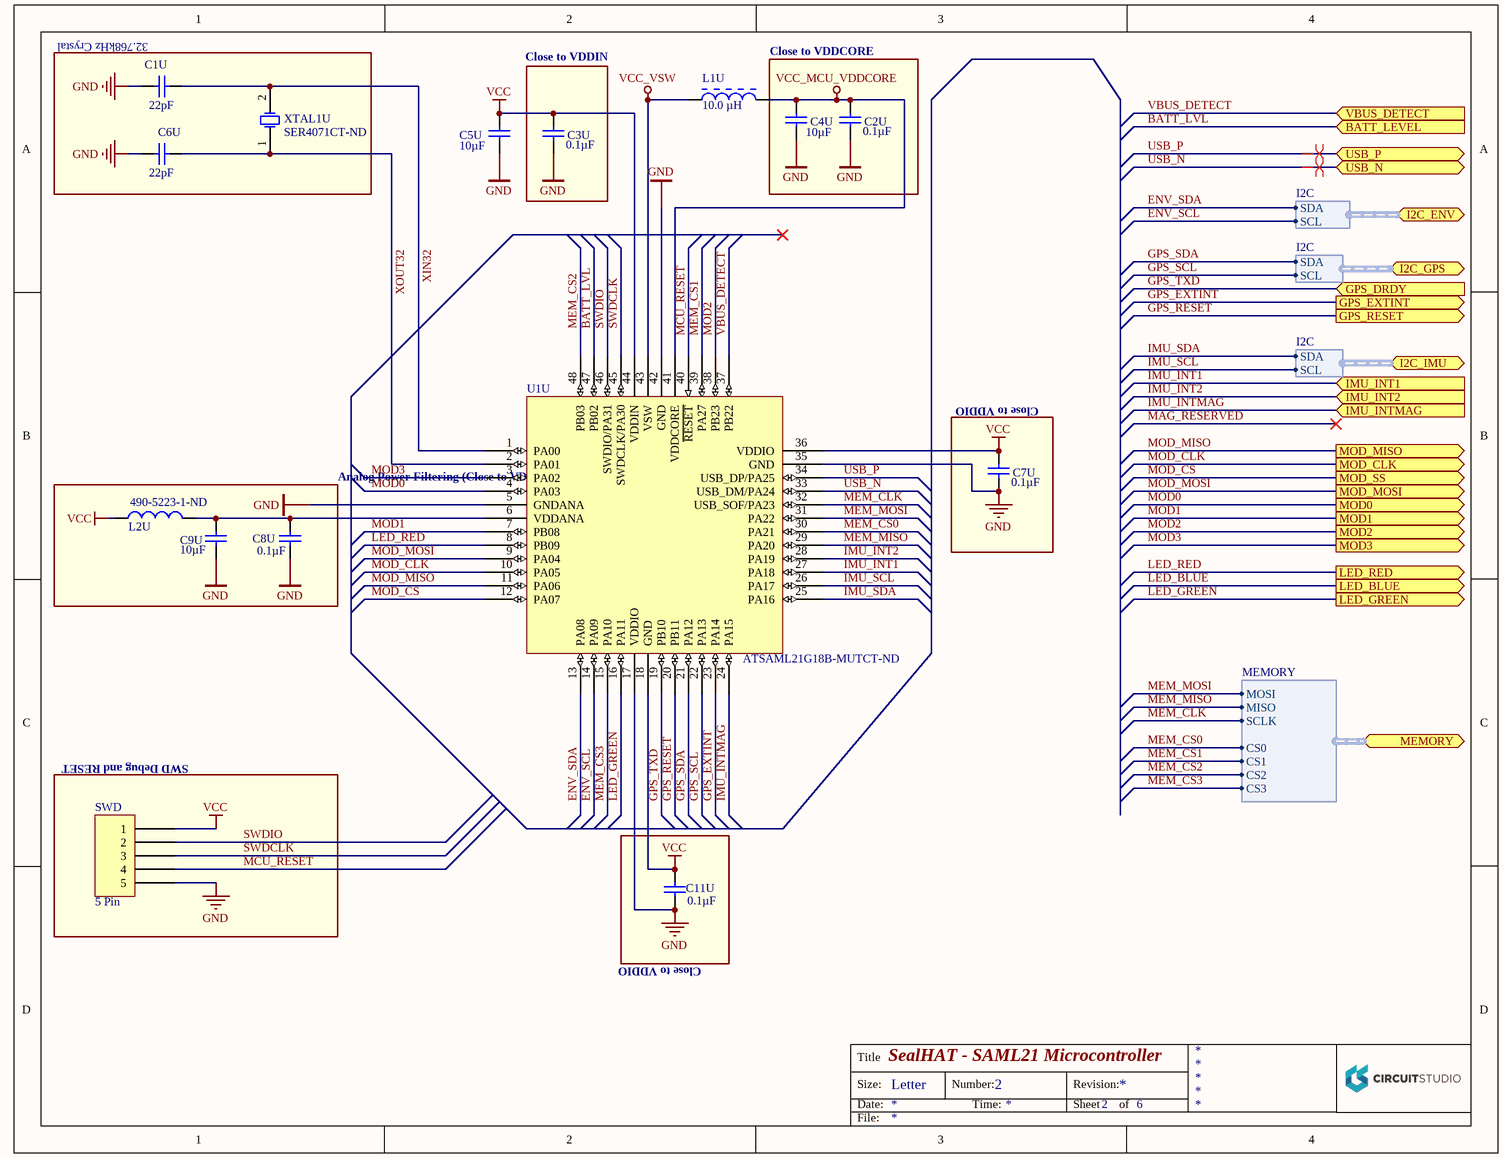
[diagram p5: MicroController.SchDoc]

### Parts
C1U  Capacitance: 22pF  [C0402M]  (hidden comment: GRM1555C1H220FA01D)
C2U  Capacitance: 0.1µF  [C0603N]  (hidden comment: GCM188R71C104KA37D)
C3U  Capacitance: 0.1µF  [C0603N]  (hidden comment: GCM188R71C104KA37D)
C4U  Capacitance: 10µF  [C0603N]  (hidden comment: GRT188R61C106KE13D)
C5U  Capacitance: 10µF  [C0603N]  (hidden comment: GRT188R61C106KE13D)
C6U  Capacitance: 22pF  [C0402M]  (hidden comment: GRM1555C1H220FA01D)
C7U  Capacitance: 0.1µF  [C0603N]  (hidden comment: GCM188R71C104KA37D)
C8U  Capacitance: 0.1µF  [C0603N]  (hidden comment: GCM188R71C104KA37D)
C9U  Capacitance: 10µF  [C0603N]  (hidden comment: GRT188R61C106KE13D)
C11U  Capacitance: 0.1µF  [C0603N]  (hidden comment: GCM188R71C104KA37D)
L1U  Inductance: 10.0 µH  [SRN3015]  (hidden comment: SRN3015-100M)
L2U  Supplier Part Number 1: 490-5223-1-ND  [R0603N]  (hidden comment: BLM18PG471SN1D)
SWD  5 Pin  [Pinhead254_90_1x5]
U1U  Supplier Part Number 1: ATSAML21G18B-MUTCT-ND  [TQFP48_7X7_P50]  (hidden comment: ATSAML21G18B-MUT)
XTAL1U  Supplier Part Number 1: SER4071CT-ND  [FC-135R$2F$FC-135]  (hidden comment: FC-135 32.7680KA-A3)

### Blocks framed on the sheet
32.768kHz Crystal: C1U C6U XTAL1U
Close to VDDIN: C3U
Close to VDDCORE: C2U C4U
Close to VDDIO: C7U
Analog Power Filtering (Close to VDDANA/GNDANA): C8U C9U L2U
SWD Debug and RESET: SWD
Close to VDDIO: C11U

### Ports
BATT_LEVEL (in), GPS_DRDY (in), GPS_EXTINT (out), GPS_RESET (out), I2C_ENV (harness I2C), I2C_GPS (harness I2C), I2C_IMU (harness I2C), IMU_INT1 (in), IMU_INT2 (in), IMU_INTMAG (in), LED_BLUE (out), LED_GREEN (out), LED_RED (out), MEMORY (harness MEMORY), MOD0 (out), MOD1 (out), MOD2 (out), MOD3 (out), MOD_CLK (out), MOD_MISO (out), MOD_MOSI (out), MOD_SS (out), USB_N (bidir), USB_P (bidir), VBUS_DETECT (in)

### Harnesses
I2C: SDA, SCL
I2C: SCL, SDA
MEMORY: MOSI, MISO, SCLK, CS0, CS1, CS2, CS3

### Nets
GND: C1U.2 C2U.1 C3U.1 C4U.1 C5U.1 C6U.2 C7U.1 C8U.2 C9U.1 C11U.2 SWD.5 U1U.5(GNDANA) U1U.17(VDDIO) U1U.35(GND) U1U.42(GND)
VCC: C3U.2 C5U.2 C7U.2 C11U.1 L2U.1 SWD.1 U1U.18(GND) U1U.36(VDDIO) U1U.44(VDDIN)
VCC_MCU_VDDCORE: C2U.2 C4U.2 L1U.2 U1U.41(VDDCORE)
VCC_VSW: L1U.1 U1U.43(VSW)
BATT_LVL: U1U.47(PB02) ; port BATT_LEVEL  [project net BATLVL]
ENV_SCL: U1U.14(PA09) ; port I2C_ENV.SCL
ENV_SDA: U1U.13(PA08) ; port I2C_ENV.SDA
GPS_EXTINT: U1U.23(PA14) ; port GPS_EXTINT
GPS_RESET: U1U.20(PB11) ; port GPS_RESET
GPS_SCL: U1U.22(PA13) ; port I2C_GPS.SCL
GPS_SDA: U1U.21(PA12) ; port I2C_GPS.SDA
GPS_TXD: U1U.19(PB10) ; port GPS_DRDY
IMU_INT1: U1U.27(PA18) ; port IMU_INT1
IMU_INT2: U1U.28(PA19) ; port IMU_INT2
IMU_INTMAG: U1U.24(PA15) ; port IMU_INTMAG
IMU_SCL: U1U.26(PA17) ; port I2C_IMU.SCL
IMU_SDA: U1U.25(PA16) ; port I2C_IMU.SDA
LED_GREEN: U1U.16(PA11) ; port LED_GREEN
LED_RED: U1U.8(PB09) ; port LED_RED
MCU_RESET: SWD.4 U1U.40(~{RESET})
MEM_CLK: U1U.32(USB_SOF/PA23) ; port MEMORY.SCLK
MEM_CS0: U1U.30(PA21) ; port MEMORY.CS0  [project net CS0]
MEM_CS1: U1U.39(PA27) ; port MEMORY.CS1  [project net CS1]
MEM_CS2: U1U.48(PB03) ; port MEMORY.CS2  [project net CS2]
MEM_CS3: U1U.15(PA10) ; port MEMORY.CS3  [project net CS3]
MEM_MISO: U1U.29(PA20) ; port MEMORY.MISO
MEM_MOSI: U1U.31(PA22) ; port MEMORY.MOSI
MOD0: U1U.4(PA03) ; port MOD0
MOD1: U1U.7(PB08) ; port MOD1
MOD2: U1U.38(PB23) ; port MOD2
MOD3: U1U.3(PA02) ; port MOD3
MOD_CLK: U1U.10(PA05) ; port MOD_CLK
MOD_CS: U1U.12(PA07) ; port MOD_SS
MOD_MISO: U1U.11(PA06) ; port MOD_MISO
MOD_MOSI: U1U.9(PA04) ; port MOD_MOSI
SWDCLK: SWD.3 U1U.45(SWDCLK/PA30)
SWDIO: SWD.2 U1U.46(SWDIO/PA31)
USB_N: U1U.33(USB_DM/PA24) ; port USB_N
USB_P: U1U.34(USB_DP/PA25) ; port USB_P
VBUS_DETECT: U1U.37(PB22) ; port VBUS_DETECT
XIN32: C1U.1 U1U.1(PA00) XTAL1U.2(X2)
XOUT32: C6U.1 U1U.2(PA01) XTAL1U.1(X1)
NetC8U_1: C8U.1 C9U.2 L2U.2 U1U.6(VDDANA)

### Layout directives
differential pair: USB_N, USB_P

### Notes on the sheet
- Title
- Size:
- Date:
- Letter
- Number:
- Time:
- Revision:
- Sheet
- of
- File:

### Library data of the parts
C1U C6U = CAPACITOR_NP: CAP CER 22PF 50V C0G/NP0 0402; HOUSEPART: NO; POPULATE: 1; TOLERANCE: ±1%; Temperature Coefficient: X5R; DeviceName: GRM1555C1H220FA01D; LibraryName: MF_Passives; DeviceSetName: CAPACITOR_NP; MPN: GRM1555C1H220FA01D; URL: https://octopart.com/grm1555c1h220fa01d-murata-21524193; VOLTAGE: 50V; MF_PARTNUM: GRM1555C1H220FA01D; Supplier 1: Digi-Key; Supplier Part Number 1: 490-8589-1-ND
C2U C3U C7U C8U C11U = CAPACITOR_NP: as C2E on sheet Environmental; DeviceName: GCM188R71C104KA37D; LibraryName: MF_Passives; DeviceSetName: CAPACITOR_NP; MPN: GCM188R71C104KA37D; MF_PARTNUM: GCM188R71C104KA37D; Supplier 1: Digi-Key; Supplier Part Number 1: 490-4774-1-ND
C4U C5U C9U = CAPACITOR_NP: as C1B on sheet Top; DeviceName: GRT188R61C106KE13D; LibraryName: MF_Passives; DeviceSetName: CAPACITOR_NP; MPN: GRT188R61C106KE13D; MF_PARTNUM: GRT188R61C106KE13D; Supplier 1: Digi-Key; Supplier Part Number 1: 490-12317-1-ND
L1U = CMP-911278-2: Semi-shielded Power Inductor, 10 uH, +/- 20%, 1 A, -40 to 125 degC, 3 x 3 x 1.5 mm SMD, RoHS and Halogen Free, Tape and Reel; Self Resonant Frequency: 45000000.0 Hz; Number of Pins: 2; Octopart Url: https://octopart.com/srn3015-100m-bourns-20579191; OctopartID: 45668d5663779aa1; Packaging: Tape & Reel (TR); REACH SVHC Compliance: No SVHC; RoHS: Compliant; Manufacturer Part Number: SRN3015-100M; Supplier 1: Digi-Key; Supplier Part Number 1: SRN3015TA-100MCT-ND
L2U = INDUCTOR: FERRITE BEAD 470 OHM 0603 1LN; HOUSEPART: NO; MPN: LI0603G221R-10; POPULATE: 1; LibraryName: MF_Passives; DeviceSetName: INDUCTOR; Supplier 1: Digi-Key
U1U = ATSAML21G18B-MUT: RAM Memory Size: 32768 B; Octopart URL: https://octopart.com/atsaml21g18b-mut-microchip-77761695; RoHS: Compliant; OctopartID: 3cd3f17b952ae314; Manufacturer Part Number: ATSAML21G18B-MUT; Supplier 1: Digi-Key
XTAL1U = FC-13532.7680KA-A3: FC-135 Series 32.768 KHz ±20 ppm 12.5 pF -40 to +85°C Surface Mount Crystal; manufacturer: epson; Octopart URL: https://octopart.com/fc-135+32.7680ka-a3-epson-39545807; Manufacturer Part Number: FC-135 32.7680KA-A3; Case/Package: FC-135; Supplier 1: Digi-Key

## Nets that join several sheets
GND: Top (21 pins), Environmental (6 pins), GPS (12 pins), Memory (13 pins), IMU (5 pins), MicroController (15 pins)
VCC: Top (9 pins), Environmental (6 pins), GPS (8 pins), Memory (10 pins), IMU (7 pins), MicroController (9 pins)
BATLVL: Top (R3B1.2 R3B2.2 R4B.1), MicroController (U1U.47)
CS0: Memory (MEM1.5 SD1.2), MicroController (U1U.30)
CS1: Memory (MEM1.13 SD1.8), MicroController (U1U.39)
CS2: Memory (MEM1.3 SD1.1), MicroController (U1U.48)
CS3: Memory (MEM1.10 SD1.9), MicroController (U1U.15)
ENV_SCL: Environmental (R2E.1 U1E.5 U2E.6), MicroController (U1U.14)
ENV_SDA: Environmental (R1E.1 U1E.6 U2E.1), MicroController (U1U.13)
GPS_EXTINT: GPS (U1G.19), MicroController (U1U.23)
GPS_RESET: GPS (U1G.18), MicroController (U1U.20)
GPS_SCL: GPS (R1G.1 U1G.12), MicroController (U1U.22)
GPS_SDA: GPS (R2G.1 U1G.9), MicroController (U1U.21)
GPS_TXD: GPS (L1G.1), MicroController (U1U.19)
IMU_INT1: IMU (U1I.12), MicroController (U1U.27)
IMU_INT2: IMU (U1I.11), MicroController (U1U.28)
IMU_INTMAG: IMU (U1I.7), MicroController (U1U.24)
IMU_SCL: IMU (R2I.1 U1I.1), MicroController (U1U.26)
IMU_SDA: IMU (R3I.1 U1I.4), MicroController (U1U.25)
LED_GREEN: Top (R14T.2), MicroController (U1U.16)
LED_RED: Top (R15T.2), MicroController (U1U.8)
MEM_CLK: Memory (MEM1.9 SD1.5), MicroController (U1U.32)
MEM_MISO: Memory (MEM1.11 SD1.7), MicroController (U1U.29)
MEM_MOSI: Memory (MEM1.7 SD1.3), MicroController (U1U.31)
MOD0: Top (J3T.5), MicroController (U1U.4)
MOD1: Top (J3T.4), MicroController (U1U.7)
MOD2: Top (J3T.3), MicroController (U1U.38)
MOD3: Top (J3T.2), MicroController (U1U.3)
MOD_CLK: Top (J2T.3), MicroController (U1U.10)
MOD_CS: Top (J2T.5), MicroController (U1U.12)
MOD_MISO: Top (J2T.4), MicroController (U1U.11)
MOD_MOSI: Top (J2T.2), MicroController (U1U.9)
USB_N: Top (U2T.3 USB.2), MicroController (U1U.33)
USB_P: Top (U2T.2 USB.3), MicroController (U1U.34)
VBUS_DETECT: Top (R7T.1 R8T1.2), MicroController (U1U.37)